# Altium project ECE453-Base.PrjPcb
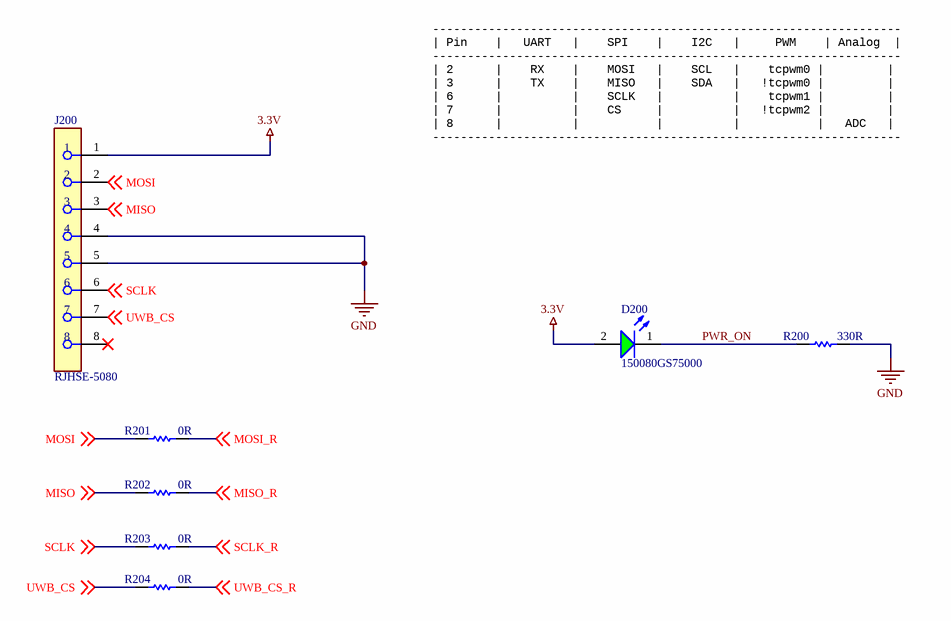
[diagram p0: 02_Connectors.SchDoc]
3 sheets, 22 parts. Net scope: global (net labels, ports and power ports of the same name join across sheets).
Board file: ECE453.PcbDoc
Sheets:
  02_Connectors.SchDoc
  03_ICs.SchDoc
  04_Mechanical.SchDoc

## Sheet 02_Connectors.SchDoc: Off Board Connectors
size A; Revision: A; SheetNumber: 2; SheetTotal: 4; ECE315_Project_Name: ECE453 F23 Base Project

### Parts
D200  150080GS75000  [WL-SMCW_0805_150080xx75000]
J200  RJHSE-5080  [FP-RJHSE-5080-MFG]
R200  330R  [RESC2013X60X40LL20T25]
R201  0R  [RESC2013X70X40NL20T20]
R202  0R  [RESC2013X70X40NL20T20]
R203  0R  [RESC2013X70X40NL20T20]
R204  0R  [RESC2013X70X40NL20T20]

### Nets
3.3V: D200.2(A) J200.1
GND: J200.4 J200.5 R200.2
MISO: J200.3 R202.1 ; off-sheet MISO
MISO_R: R202.2 ; off-sheet MISO_R
MOSI: J200.2 R201.1 ; off-sheet MOSI
MOSI_R: R201.2 ; off-sheet MOSI_R
PWR_ON: D200.1(K) R200.1
SCLK: J200.6 R203.1 ; off-sheet SCLK
SCLK_R: R203.2 ; off-sheet SCLK_R
UWB_CS: J200.7 R204.1 ; off-sheet UWB_CS
UWB_CS_R: R204.2 ; off-sheet UWB_CS_R

Not connected (* = marked no-connect by the designer): J200 8*

### Notes on the sheet
- -------------------------------------------------------------------
  | Pin    |   UART   |    SPI    |    I2C   |     PWM    | Analog  |
  -------------------------------------------------------------------
  | 2      |    RX    |    MOSI   |    SCL   |    tcpwm0 |         |
  | 3      |    TX    |    MISO   |    SDA   |   !tcpwm0 |         |
  | 6      |          |    SCLK   |          |    tcpwm1 |         |
  | 7      |          |    CS     |          |   !tcpwm2 |         |
  | 8      |          |           |          |           |   ADC   |
  -------------------------------------------------------------------
- Title:
- Size:
- A
- Project
- Rev:
- Sheet:
- of
- College of Engineering
- 1415 Engineering Drive
- Madison, WI 53706

### Library data of the parts
D200 = CMP-1426-00007-2: NexarPartId: 29717780; Manufacturer: Wurth Electronics; Wavelength: 520nm; Forward Current: 100mA; Lens Style: Clear, Rectangular; Dominant Wavelength: 525nm; Max Junction Temperature (Tj): 95°C; Power Dissipation: 105mW; Luminous Intensity: 450mcd; Peak Wavelength: 515nm; Color: Green; Viewing Angle: 140°; Test Current: 20mA; Reverse Voltage: 5V; Forward Voltage: 3.2V; Lens Color: Colorless; Lens Transparency: Clear; Lens Size: 1.25mm; Mount: Surface Mount; REACH SVHC: Unknown; Min Operating Temperature: -40°C; Case Code (Imperial): 0805; Case/Package: 0805; Max Operating Temperature: 85°C; RoHS: Compliant; Length: 2mm; Height: 700µm; Width: 1.25mm; Case Code (Metric): 2012; Packaging: Tape and Reel; Max Reverse Voltage (DC): 5V; Supplier: Digikey; Supplier Part Number: 732-4983-1-ND; Manufacturer Part Number: 150080GS75000; Category: LEDs; Stock: 29733; Pricing: 1=0.19, 50=0.176, 100=0.151, 500=0.131 (USD); Mounting Technology: Surface Mount; Package Quantity: 1; Series: WL-SMCW; RoHS Compliant: Yes; Reach SVHC Compliant: Unknown; ComponentLink1URL: https://datasheet.ciiva.com/29563/150080gs75000-29563008.pdf?src-supplier=Digikey; ComponentLink1Description: https://datasheet.ciiva.com/29563/150080gs75000-29563008.pdf?src-supplier=Digikey; ComponentLink2URL: https://datasheet.ciiva.com/29279/759434-da-01-en-chipled-0805-w-kl-gruen-150080gs75000-29279039.pdf?src-supplier=Conrad; ComponentLink2Description: https://datasheet.ciiva.com/29279/759434-da-01-en-chipled-0805-w-kl-gruen-150080gs75000-29279039.pdf?src-supplier=Conrad
J200 = CMP-02366-000003-1: CONN MOD JACK 8P8C R/A UNSHLD; Manufacturer: Amphenol; Current Rating: 1.5A; Voltage Rating: 125V; Pitch: 1.02mm; Conn Orientation: Right Angle; Number Of Contacts: 8; Is Female: yes; Conn Gender: Female; Contact Resistance: 20mR; Number of Ports: 1; Connector Type: RJ45; Lead Free: Yes; Device Class L3: unset; Footprint Url: https://cdn.amphenol-icc.com/media/wysiwyg/files/drawing/rjhse5080.pdf?__cf_chl_jschl_tk__=e349db0bbbb6188a39347cd5e541b92fa02c9719-1587748343-0-AW7tChdeHzRPLX9gSWj7WrKaXQoY9BsmT9Ek0h-T62M9y3Rs9iypFcOtkzb-6sGYQEjFE-jcoNciDETCOZrh1rYyOesac5SvYLoLwHIsHvF4AKBlx-MXmfZUVk9OTTJLqyQq2qMm0PFRLJpNcK0nrKResqOniRSYixG2sPTmOPraH-ULJFBDL602CHqcI9KKBgTq90Jh1OL2Td4moJ99rFsJRJ1Tk_uoxGe8ublcP_ARu-uLpWcQrBcwOcHDTAwL29DAwVaqcH7ta8Ks7WMlHmVl_pILeEDwT0bE9vu5Pa5S3PtNRF1leuFkgi_FMbUxTDulc5xzbXSfng8srUIV1lWXny5nx1fZJEUa_w97yKjffzBMxiWLWVN-V7-uqAaPbyv_m-wRyw5O25OZNyJOeGU; ComponentLink2URL: https://cdn.amphenol-icc.com/media/wysiwyg/files/documentation/datasheet/inputoutput/io-modjack-rjhse.pdf; Device Class L1: Connectors; Package: CONN_MOD_JACK; Mouser Description: Modular Connectors / Ethernet Connectors R/A RJ45 NONSHIELDED 8 CONT NO LEDS; Manufacturer Part Number: RJHSE-5080; Octopart: https://octopart.com/rjhse-5080-amphenol-45060; Category: Conn; Height: 0.535inch; Temperature: -55°C to +85°C; Digikey Description: CONN MOD JACK 8P8C R/A UNSHLD; Device Class L2: Modular / Ethernet Connectors; Contact Material: Gold,Nickel; ComponentLink2Description: Datasheet; Temperature Range Low: -55°C; RoHS: TRUE; Automotive: No; Temperature Range High: +85°C; Supplier: Digikey; Supplier Part Number: RJHSE-5080-ND; Stock: 72112; Pricing: 1=1.03, 10=0.867, 25=0.832, 50=0.8142, 100=0.7788, 250=0.708, 500=0.6372, 1000=0.56641, 2500=0.51331 (USD); Mounting Technology: Through Hole,Panel; Contact Plating: Gold; Max Current Rating: 1.5A; Number of Positions Loaded: 8; Max Voltage Rating (AC): 125V; Orientation: Right Angle; Packaging: Rail/Tube; Gender: Female; Termination: Solder; Number of Positions: 8; Voltage Rating (DC): 125V; Length: 15.75mm; Depth: 14.99mm; Radiation Hardening: No; RoHS Compliant: Yes; Reach SVHC Compliant: Unknown; ComponentLink1URL: https://datasheet.ciiva.com/7629/1682821-7629402.pdf?src-supplier=Element14; ComponentLink1Description: https://datasheet.ciiva.com/7629/1682821-7629402.pdf?src-supplier=Element14; ComponentLink3URL: https://datasheet.ciiva.com/1432/1693748-1432448.pdf?src-supplier=Element14; ComponentLink3Description: https://datasheet.ciiva.com/1432/1693748-1432448.pdf?src-supplier=Element14
R200 = CMP-2001-00628-1: Manufacturer: Panasonic; Part Number: ERA6AEB331V; Manufacturer Part Number: ERA-6AEB331V; Tolerance: 0.1%; Power: 125mW; Rated Temperature: 85°C; Temperature Coefficient: 25ppm/°C; Working Voltage: 100V; Package Height: 0.5mm; Package Length: 2mm; Package Width: 1.25mm; Reference Standard: AEC-Q200; Supplier: Digikey; Supplier Part Number: P330DACT-ND; RoHS: Yes; Category: Chip SMD Resistors; Stock: 18932; Pricing: 1=0.13, 10=0.095, 50=0.0748, 100=0.067, 500=0.05106, 1000=0.04511 (USD); Mounting Technology: Surface Mount; Pins: 2; Case/Package: 0805; Terminal Finish: Nickel; Min Operating Temperature: -55°C; Max Operating Temperature: 155°C; JESD-609 Code: e3; Resistor Type: FIXED RESISTOR; Construction: Rectangular; Package Style: SMTMeter; Packaging: Tape and Reel; Value: 330R; Technology: THIN FILM; Termination: Wraparound; Reach SVHC Compliant: Yes; RoHS Compliant: Yes; ComponentLink1URL: https://datasheet.ciiva.com:443/pdfs/VipMasterIC/IC/PANA/PANA-S-A0009459258/PANA-S-A0009459258-1.pdf?src-supplier=IHS+Markit; ComponentLink1Description: https://datasheet.ciiva.com:443/pdfs/VipMasterIC/IC/PANA/PANA-S-A0009459258/PANA-S-A0009459258-1.pdf?src-supplier=IHS+Markit; ComponentLink2URL: https://datasheet.ciiva.com/11808/0900766b80eb1d8c-11808093.pdf?src-supplier=Rs; ComponentLink2Description: https://datasheet.ciiva.com/11808/0900766b80eb1d8c-11808093.pdf?src-supplier=Rs; ComponentLink3URL: https://datasheet.ciiva.com/29184/452857-da-01-en-widerstand-0805-era-29184079.pdf?src-supplier=Conrad; ComponentLink3Description: https://datasheet.ciiva.com/29184/452857-da-01-en-widerstand-0805-era-29184079.pdf?src-supplier=Conrad; ComponentLink4URL: https://datasheet.ciiva.com/30237/54aoa0000ce26-30237450.pdf?src-supplier=Onlinecomponents.com; ComponentLink4Description: https://datasheet.ciiva.com/30237/54aoa0000ce26-30237450.pdf?src-supplier=Onlinecomponents.com; ComponentLink5URL: https://datasheet.ciiva.com/16777/70068849-16777611.pdf?src-supplier=Allied+Electronics; ComponentLink5Description: https://datasheet.ciiva.com/16777/70068849-16777611.pdf?src-supplier=Allied+Electronics; ComponentLink6URL: https://datasheet.ciiva.com/9182/aoa0000ce26-9182968.pdf?src-supplier=Avnet; ComponentLink6Description: https://datasheet.ciiva.com/9182/aoa0000ce26-9182968.pdf?src-supplier=Avnet; ComponentLink7URL: https://datasheet.ciiva.com/48536/era-eng-tds-48536857.pdf?src-supplier=Distrelec; ComponentLink7Description: https://datasheet.ciiva.com/48536/era-eng-tds-48536857.pdf?src-supplier=Distrelec; ComponentLink8URL: https://datasheet.ciiva.com/22744/1776116-22744153.pdf?src-supplier=Element14; ComponentLink8Description: https://datasheet.ciiva.com/22744/1776116-22744153.pdf?src-supplier=Element14; ComponentLink9URL: https://datasheet.ciiva.com/46436/485442-46436606.pdf?src-supplier=Element14; ComponentLink9Description: https://datasheet.ciiva.com/46436/485442-46436606.pdf?src-supplier=Element14; ComponentLink10URL: https://datasheet.ciiva.com/6138/485442-6138585.pdf?src-supplier=Farnell; ComponentLink10Description: https://datasheet.ciiva.com/6138/485442-6138585.pdf?src-supplier=Farnell; ComponentLink11URL: https://datasheet.ciiva.com/6138/485442-6138589.pdf?src-supplier=Farnell; ComponentLink11Description: https://datasheet.ciiva.com/6138/485442-6138589.pdf?src-supplier=Farnell; ComponentLink12URL: https://datasheet.ciiva.com/22759/485442-22759176.pdf?src-supplier=Farnell; ComponentLink12Description: https://datasheet.ciiva.com/22759/485442-22759176.pdf?src-supplier=Farnell; ComponentLink13URL: https://datasheet.ciiva.com/43457/485442-43457816.pdf?src-supplier=Farnell; ComponentLink13Description: https://datasheet.ciiva.com/43457/485442-43457816.pdf?src-supplier=Farnell; ComponentLink14URL: https://datasheet.ciiva.com/24164/aoa0000ce26-197354-24164407.pdf?src-supplier=Mouser; ComponentLink14Description: https://datasheet.ciiva.com/24164/aoa0000ce26-197354-24164407.pdf?src-supplier=Mouser
R201-R204 = CMP-1665-00002-5: Chip Resistor, 0 Ohm, +/- 1%, 0.125 W, -55 to 155 degC, 0805 (2012 Metric), RoHS, Tape and Reel; PartNumber: ERJ-6GEY0R00V; Manufacturer: Panasonic; Tolerance: 5%; Resistance: 0 Ohm; Power: 125mW; Rated Temperature: 70°C; Package Height: 0.6mm; Package Length: 2mm; Package Width: 1.25mm; Reference Standard: AEC-Q200; REACH SVHC: No SVHC; Min Operating Temperature: -55 degC; Case/Package: 0805; Packaging: Tape and Reel; Package Quantity: 5000; ComponentLink1Description: Manufacturer URL; PackageDescription: 2-Pin Surface Mount Device, Body 2 x 1.25 mm; Mounting Technology: Surface Mount; Max Operating Temperature: 155 degC; Width: 1.25 mm; RoHSCompliant: True; Height: 0.6 mm; ComponentLink1URL: http://www.panasonic.com/; ComponentLink2URL: http://industrial.panasonic.com/cdbs/www-data/pdf/RDA0000/AOA0000C84.pdf; Case Code (Imperial): 0805; DatasheetVersion: 03/2015; Length: 2 mm; Case Code (Metric): 2012; ComponentLink2Description: Datasheet; Radiation Hardening: No; Supplier: Digikey; Supplier Part Number: P0.0ACT-ND; Manufacturer Part Number: ERJ-6GEY0R00V; RoHS: Yes; Category: Chip SMD Resistors; Stock: 179566; Pricing: 1=0.1, 10=0.057, 25=0.0432, 50=0.033, 100=0.0231, 250=0.01856, 500=0.01484, 1000=0.01092 (USD); Pins: 2; Package Shape: Rectangular; Terminal Finish: Nickel; JESD-609 Code: e3; Resistor Type: FIXED RESISTOR; Construction: Rectangular; Package Style: SMTMeter; Value: 0R; Technology: METAL GLAZE/THICK FILM; Termination: Wraparound; Reach SVHC Compliant: Yes; RoHS Compliant: Yes; ComponentLink3URL: https://datasheet.ciiva.com:443/pdfs/VipMasterIC/IC/PANA/PANA-S-A0009459603/PANA-S-A0009459603-1.pdf?src-supplier=IHS+Markit; ComponentLink3Description: https://datasheet.ciiva.com:443/pdfs/VipMasterIC/IC/PANA/PANA-S-A0009459603/PANA-S-A0009459603-1.pdf?src-supplier=IHS+Markit; ComponentLink4URL: https://datasheet.ciiva.com/36526/1989607-36526237.pdf?src-supplier=Jameco; ComponentLink4Description: https://datasheet.ciiva.com/36526/1989607-36526237.pdf?src-supplier=Jameco; ComponentLink5URL: https://datasheet.ciiva.com/11821/0900766b80f806dd-11821735.pdf?src-supplier=Rs; ComponentLink5Description: https://datasheet.ciiva.com/11821/0900766b80f806dd-11821735.pdf?src-supplier=Rs; ComponentLink6URL: https://datasheet.ciiva.com/43460/1678796-43460073.pdf?src-supplier=Farnell; ComponentLink6Description: https://datasheet.ciiva.com/43460/1678796-43460073.pdf?src-supplier=Farnell; ComponentLink7URL: https://datasheet.ciiva.com/46377/1678796-46377866.pdf?src-supplier=Element14; ComponentLink7Description: https://datasheet.ciiva.com/46377/1678796-46377866.pdf?src-supplier=Element14; ComponentLink8URL: https://datasheet.ciiva.com/28695/1678796-28695877.pdf?src-supplier=Element14; ComponentLink8Description: https://datasheet.ciiva.com/28695/1678796-28695877.pdf?src-supplier=Element14; ComponentLink9URL: https://datasheet.ciiva.com/9117/aoa0000ce1-9117354.pdf?src-supplier=Avnet; ComponentLink9Description: https://datasheet.ciiva.com/9117/aoa0000ce1-9117354.pdf?src-supplier=Avnet

## Sheet 03_ICs.SchDoc: ICs
size A; Revision: A; SheetNumber: 3; SheetTotal: 4; ECE315_Project_Name: ECE453 F23 Base Project

### Notes on the sheet
- Title:
- Size:
- A
- Project
- Rev:
- Sheet:
- of
- College of Engineering
- 1415 Engineering Drive
- Madison, WI 53706

## Sheet 04_Mechanical.SchDoc: Mechanicals
size A; Revision: A; SheetNumber: 4; SheetTotal: 4; ECE315_Project_Name: ECE453 Base Project
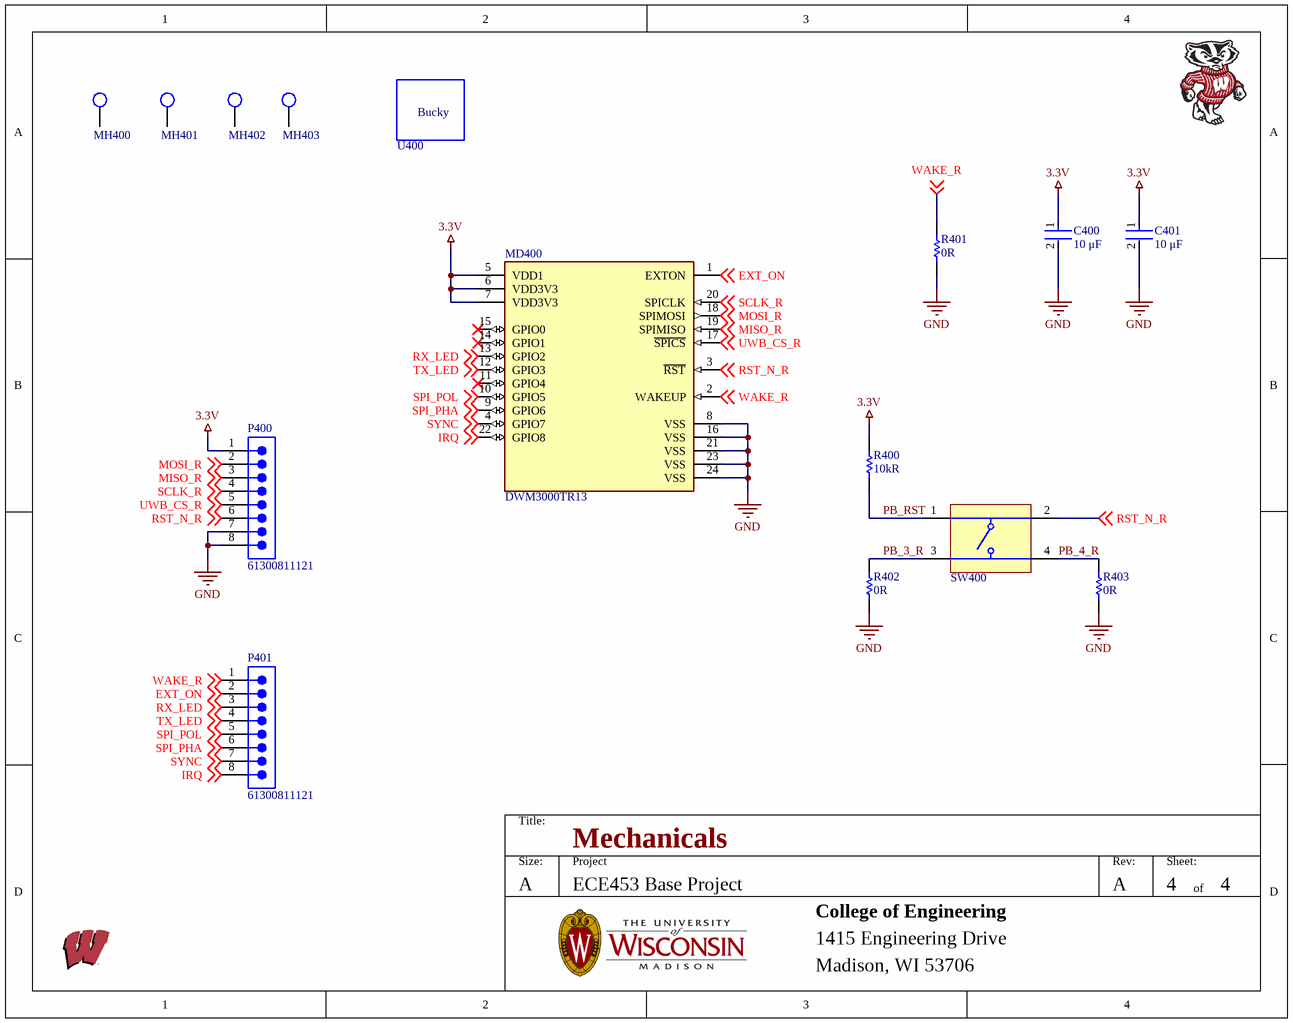
[diagram p1: 04_Mechanical.SchDoc]

### Parts
C400  10 μF  [FP-C0805C-DG-MFG]
C401  10 μF  [FP-C0805C-DG-MFG]
MD400  DWM3000TR13  [FP-DWM3000TR13-MFG]
MH400  MHOLE_2_55MM  [MHOLE_2_55MM]  (value not drawn)
MH401  MHOLE_2_55MM  [MHOLE_2_55MM]  (value not drawn)
MH402  MHOLE_2_55MM  [MHOLE_2_55MM]  (value not drawn)
MH403  MHOLE_2_55MM  [MHOLE_2_55MM]  (value not drawn)
P400  61300811121  [61300811121]
P401  61300811121  [61300811121]
R400  10kR  [RESC2013X70X40ML20T20]
R401  0R  [RESC2013X70X40NL20T20]
R402  0R  [RESC2013X70X40NL20T20]
R403  0R  [RESC2013X70X40NL20T20]
SW400  (no value)  [TECO-FSM4JSMA_V]
U400  Bucky  [WalkingBucky]  (value not drawn)  (no BOM)

### Nets
3.3V: C400.1 C401.1 MD400.5(VDD1) MD400.6(VDD3V3) MD400.7(VDD3V3) P400.1 R400.2
GND: C400.2 C401.2 MD400.8(VSS) MD400.16(VSS) MD400.21(VSS) MD400.23(VSS) MD400.24(VSS) P400.7 P400.8 R401.2 R402.1 R403.1
EXT_ON: MD400.1(EXTON) P401.2 ; off-sheet EXT_ON
IRQ: MD400.22(GPIO8) P401.8 ; off-sheet IRQ
MISO_R: MD400.19(SPIMISO) P400.3 ; off-sheet MISO_R
MOSI_R: MD400.18(SPIMOSI) P400.2 ; off-sheet MOSI_R
PB_3_R: R402.2 SW400.3
PB_4_R: R403.2 SW400.4
PB_RST: R400.1 SW400.1
RST_N_R: MD400.3(~{RST}) P400.6 SW400.2 ; off-sheet RST_N_R
RX_LED: MD400.13(GPIO2) P401.3 ; off-sheet RX_LED
SCLK_R: MD400.20(SPICLK) P400.4 ; off-sheet SCLK_R
SPI_PHA: MD400.9(GPIO6) P401.6 ; off-sheet SPI_PHA
SPI_POL: MD400.10(GPIO5) P401.5 ; off-sheet SPI_POL
SYNC: MD400.4(GPIO7) P401.7 ; off-sheet SYNC
TX_LED: MD400.12(GPIO3) P401.4 ; off-sheet TX_LED
UWB_CS_R: MD400.17(~{SPICS}) P400.5 ; off-sheet UWB_CS_R
WAKE_R: MD400.2(WAKEUP) P401.1 R401.1 ; off-sheet WAKE_R

Not connected (* = marked no-connect by the designer): MD400 11(GPIO4)* 14(GPIO1)* 15(GPIO0)*; MH400 1; MH401 1; MH402 1; MH403 1

### Notes on the sheet
- Title:
- Size:
- A
- Project
- Rev:
- Sheet:
- of
- College of Engineering
- 1415 Engineering Drive
- Madison, WI 53706

### Library data of the parts
C400 C401 = CMP-2007-03243-2: CAP CER 10UF 10V X5R 0805; Manufacturer Part Number: C0805C106K8PACTU; Manufacturer: Kemet; 3DS Part Number: 220-00001; Tolerance: 10%; Description: SMD Comm X5R, Ceramic, 10 uF, 10%, 10 V, X5R, SMD, MLCC, Temperature Stable, Class II, 0805; Temperature Coefficient: 15%; Material: Ceramic; Device Class L2: Capacitors; Device Class L1: Passive Components; ComponentLink2URL: https://content.kemet.com/datasheets/KEM_C1006_X5R_SMD.pdf; Height: 1.4mm; Lead Free: Yes; Digikey Description: CAP CER 10UF 10V X5R 0805; Octopart: https://octopart.com/c0805c106k8pactu-kemet-98697; Capacitance: 10uF; Value: 10uF; Temperature Range Low: -55°C; Temperature: -55°C to +85°C; Automotive: No; Mouser Description: CAP CER 10UF 10V X5R 0805; Ipc Land Pattern Name: CAPC200125X125; Temperature Range High: +85°C; Voltage: 10V; RoHS: TRUE; Device Class L3: Ceramic Capacitors; ComponentLink2Description: Datasheet; Voltage Rating: 10V; Package: C0805C-DG; Temperature Characteristic: X5R; Category: Cap
MD400 = CMP-231853-000002-1: DWM3000 module Freq: 7.9872 GHz 6.8Mbps SPI 2.5-3.6V 8 GPIO's
MH400-MH403 = MHOLE_2_55MM: Mounting Holde; Manufacturer Part Number: UW MTHOLE
P400 P401 = CMP-1502-01076-2: NexarPartId: 32855533; Manufacturer: Wurth Electronics; Current Rating: 3A; Connector Type: Male Pin; Voltage Rating: 250V; Number of Contacts: 8; Pitch: 2.54mm; Contact Resistance: 20mΩ; Gender: Male; REACH SVHC: Unknown; Number of Rows: 1; Mount: Through Hole; Termination: Solder; Number of Pins: 8; Number of Positions: 8; Height: 8.54mm; Contact Mating Length: 5.9944mm; Orientation: Vertical; Operating Supply Voltage: 250V; Min Operating Temperature: -40°C; Max Operating Temperature: 105°C; Packaging: Bulk; Color: Black; Lead Pitch: 2.54mm; RoHS: Compliant; Contact Material: Copper; Contact Plating: Gold; Supplier: Digikey; Supplier Part Number: 732-5321-ND; Manufacturer Part Number: 61300811121; Category: Headers and Wire Housings; Stock: 13018; Pricing: 1=0.4, 10=0.336, 25=0.28, 50=0.234, 100=0.212, 1000=0.193 (USD); Mounting Technology: Through Hole; Series: WR-PHD; Contact Type: Male Pin; RoHS Compliant: Yes; Reach SVHC Compliant: Unknown; ComponentLink1URL: https://datasheet.octopart.com/61300811121-W%C3%BCrth-Elektronik-datasheet-21154836.pdf?src-supplier=Element14; ComponentLink1Description: https://datasheet.octopart.com/61300811121-W%C3%BCrth-Elektronik-datasheet-21154836.pdf?src-supplier=Element14; ComponentLink2URL: https://katalog.we-online.de/em/datasheet/6130xx11121.pdf?src-supplier=Digikey; ComponentLink2Description: https://katalog.we-online.de/em/datasheet/6130xx11121.pdf?src-supplier=Digikey
R400 = CMP-2001-04376-1: Manufacturer: Panasonic; Part Number: ERJ-6ENF1002V
R401 = CMP-1665-00002-5: as R201 on sheet 02_Connectors; REACH SVHC: No SVHC; Min Operating Temperature: -55 degC; Case/Package: 0805; Packaging: Tape and Reel; Package Quantity: 5000; ComponentLink1Description: Manufacturer URL; PackageDescription: 2-Pin Surface Mount Device, Body 2 x 1.25 mm; Mounting Technology: Surface Mount; Max Operating Temperature: 155 degC; Width: 1.25 mm; RoHSCompliant: True; Height: 0.6 mm; ComponentLink1URL: http://www.panasonic.com/; ComponentLink2URL: http://industrial.panasonic.com/cdbs/www-data/pdf/RDA0000/AOA0000C84.pdf; Case Code (Imperial): 0805; DatasheetVersion: 03/2015; Length: 2 mm; Case Code (Metric): 2012; ComponentLink2Description: Datasheet; Radiation Hardening: No; Supplier: Digikey; Supplier Part Number: P0.0ACT-ND; Manufacturer Part Number: ERJ-6GEY0R00V; RoHS: Yes; Category: Chip SMD Resistors; Stock: 179566; Pricing: 1=0.1, 10=0.057, 25=0.0432, 50=0.033, 100=0.0231, 250=0.01856, 500=0.01484, 1000=0.01092 (USD); Pins: 2; Package Shape: Rectangular; Terminal Finish: Nickel; JESD-609 Code: e3; Resistor Type: FIXED RESISTOR; Construction: Rectangular; Package Style: SMTMeter; Value: 0R; Technology: METAL GLAZE/THICK FILM; Termination: Wraparound; Reach SVHC Compliant: Yes; RoHS Compliant: Yes; ComponentLink3URL: https://datasheet.ciiva.com:443/pdfs/VipMasterIC/IC/PANA/PANA-S-A0009459603/PANA-S-A0009459603-1.pdf?src-supplier=IHS+Markit; ComponentLink3Description: https://datasheet.ciiva.com:443/pdfs/VipMasterIC/IC/PANA/PANA-S-A0009459603/PANA-S-A0009459603-1.pdf?src-supplier=IHS+Markit; ComponentLink4URL: https://datasheet.ciiva.com/36526/1989607-36526237.pdf?src-supplier=Jameco; ComponentLink4Description: https://datasheet.ciiva.com/36526/1989607-36526237.pdf?src-supplier=Jameco; ComponentLink5URL: https://datasheet.ciiva.com/11821/0900766b80f806dd-11821735.pdf?src-supplier=Rs; ComponentLink5Description: https://datasheet.ciiva.com/11821/0900766b80f806dd-11821735.pdf?src-supplier=Rs; ComponentLink6URL: https://datasheet.ciiva.com/43460/1678796-43460073.pdf?src-supplier=Farnell; ComponentLink6Description: https://datasheet.ciiva.com/43460/1678796-43460073.pdf?src-supplier=Farnell; ComponentLink7URL: https://datasheet.ciiva.com/46377/1678796-46377866.pdf?src-supplier=Element14; ComponentLink7Description: https://datasheet.ciiva.com/46377/1678796-46377866.pdf?src-supplier=Element14; ComponentLink8URL: https://datasheet.ciiva.com/28695/1678796-28695877.pdf?src-supplier=Element14; ComponentLink8Description: https://datasheet.ciiva.com/28695/1678796-28695877.pdf?src-supplier=Element14; ComponentLink9URL: https://datasheet.ciiva.com/9117/aoa0000ce1-9117354.pdf?src-supplier=Avnet; ComponentLink9Description: https://datasheet.ciiva.com/9117/aoa0000ce1-9117354.pdf?src-supplier=Avnet
R402 R403 = CMP-1665-00002-5: Chip Resistor, 0 Ohm, +/- 1%, 0.125 W, -55 to 155 degC, 0805 (2012 Metric), RoHS, Tape and Reel; PartNumber: ERJ-6GEY0R00V; Tolerance: 5%; Resistance: 0 Ohm; REACH SVHC: No SVHC; Min Operating Temperature: -55 degC; Case/Package: 0805; Packaging: Tape and Reel; Package Quantity: 5000; ComponentLink1Description: Manufacturer URL; PackageDescription: 2-Pin Surface Mount Device, Body 2 x 1.25 mm; Mounting Technology: Surface Mount; Max Operating Temperature: 155 degC; Width: 1.25 mm; RoHSCompliant: True; Height: 0.6 mm; ComponentLink1URL: http://www.panasonic.com/; ComponentLink2URL: http://industrial.panasonic.com/cdbs/www-data/pdf/RDA0000/AOA0000C84.pdf; Case Code (Imperial): 0805; DatasheetVersion: 03/2015; Length: 2 mm; Case Code (Metric): 2012; ComponentLink2Description: Datasheet; Radiation Hardening: No
SW400 = CMP-2000-05602-2: Swicth, SPST, 24 V, -35 to 85 degC, 4-Pin SMD, RoHS, Tape and Reel; Manufacturer: TE Connectivity; Switch Travel: 0.25mm; Mechanical Life: 100000Cycles; Contact Current Rating: 50mA; Operating Force: 1.57N; Actuator Material: Polyamide; Contact Resistance: 100mOhm; Voltage Rating: 24V; Illumination Type: Illuminated; Actuator Length: 0.055inch; Max Voltage Rating (DC): 12V; Case\/Package: SMD/SMT; Orientation: Straight; Datasheet URL: http://www.te.com/commerce/DocumentDelivery/DDEController?Action=showdoc&DocId=Customer+Drawing%7F2-1437565-7%7FV%7Fpdf%7FEnglish%7FENG_CD_2-1437565-7_V.pdf%7F4-1437565-2; Min Operating Temperature: -35degC; Packaging: LoosePiece; Termination: GullWing; Throw Configuration: SPST; Package Description: 4-Pin Surface Mount Device, Body 6 x 6 mm, Pitch 4.5 mm; Mounting Technology: SurfaceMount; Contact Plating: Silver; Datasheet Version: Rev. V, 02/2015; RoHSCompliant: true; Max Operating Temperature: 85degC; Length: 6mm; Voltage Rating (DC): 24V; Electrical Life: 100000Cycles; Current Rating: 50mA; Package Quantity: 750; Mount: SurfaceMount; Package Reference: FSM4JSMA; Manufacturer URL: http://www.te.com/; Width: 6mm; REACH SVHC: Unknown; Contact Material: CopperAlloy
U400 = Bucky: Bucky Badger Image; Manufacturer Part Number: UW Bucky

## Nets that join several sheets
3.3V: 02_Connectors (D200.2 J200.1), 04_Mechanical (7 pins)
GND: 02_Connectors (J200.4 J200.5 R200.2), 04_Mechanical (12 pins)
MISO_R: 02_Connectors (R202.2), 04_Mechanical (MD400.19 P400.3)
MOSI_R: 02_Connectors (R201.2), 04_Mechanical (MD400.18 P400.2)
SCLK_R: 02_Connectors (R203.2), 04_Mechanical (MD400.20 P400.4)
UWB_CS_R: 02_Connectors (R204.2), 04_Mechanical (MD400.17 P400.5)